# Altium schematic sheet Sheet2.SchDoc
size A4; DrawnBy: Erhan YILMAZ; Engineer: Erhan YILMAZ; SheetNumber: 2; SheetTotal: 2; ProjectName: BMS
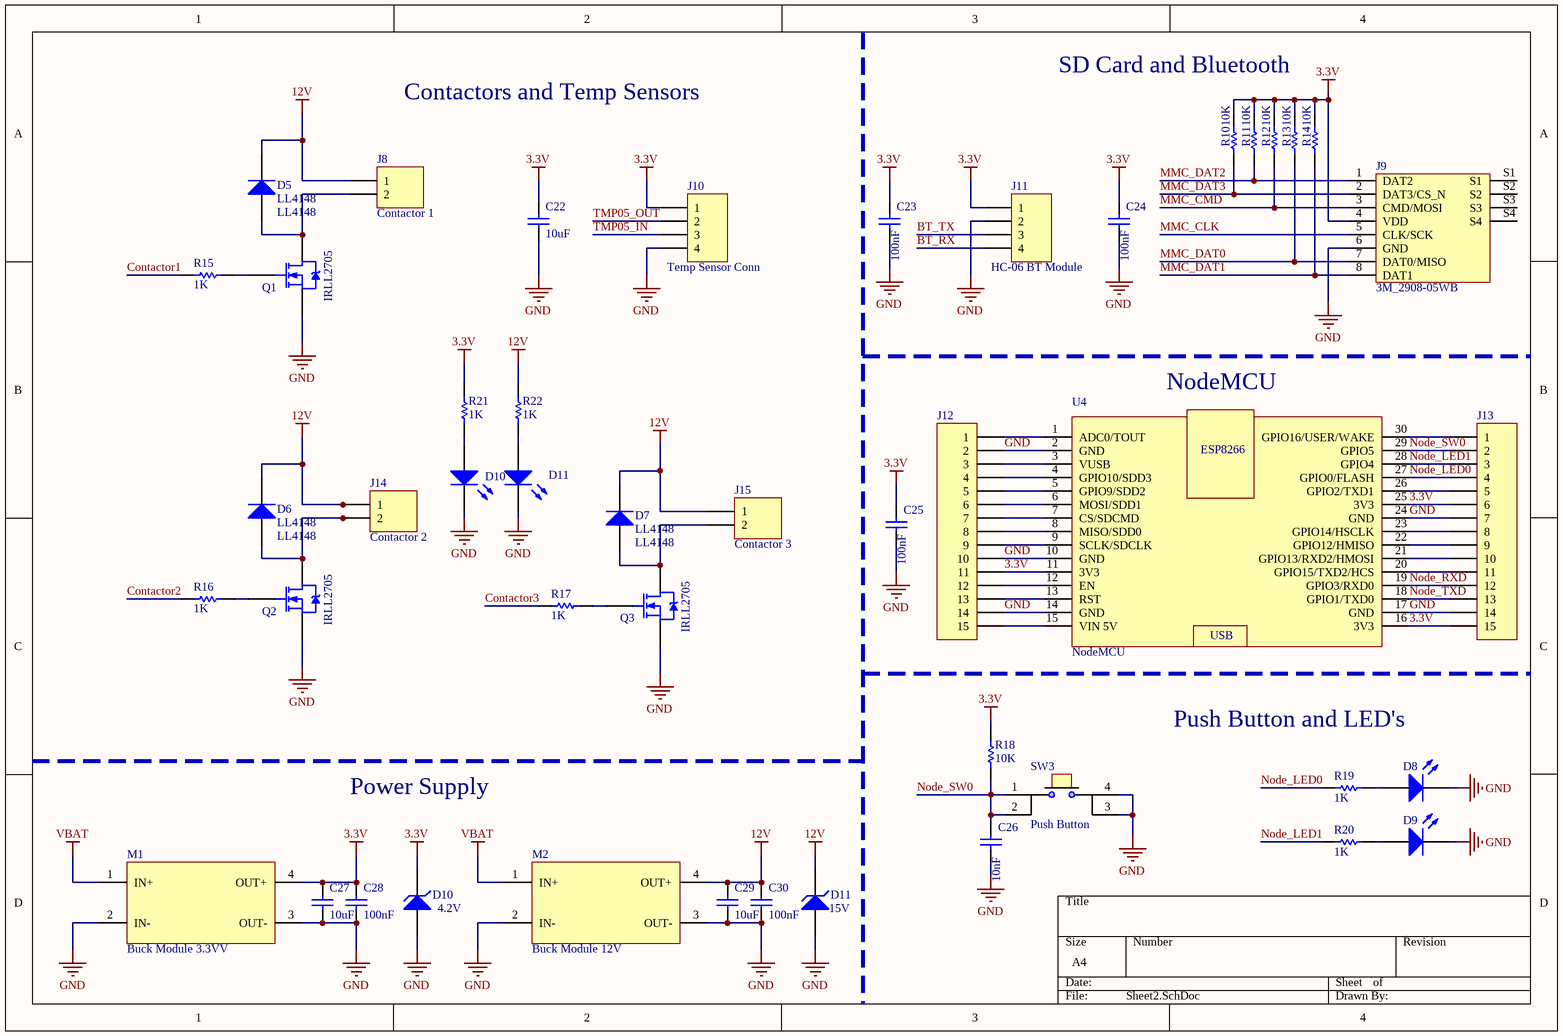
[diagram p0: Sheet2.SchDoc]

## Parts
(Parts that share a designator on the sheet are numbered #1, #2 ... from top to bottom, then left to right.)
C22  10uF  [C0805]
C23  100nF  [1608[0603]]
C24  100nF  [1608[0603]]
C25  100nF  [1608[0603]]
C26  10nF  [1608[0603]]
C27  10uF  [C0805]
C28  100nF  [1608[0603]]
C29  10uF  [C0805]
C30  100nF  [1608[0603]]
D5  LL4148  [LL4148]
D6  LL4148  [LL4148]
D7  LL4148  [LL4148]
D8  SMD LED  [C0805]  (value not drawn)
D9  SMD LED  [C0805]  (value not drawn)
D10#1  SMD LED  [C0805]  (value not drawn)
D10#2  value 4.2V  [LL4148]  (hidden comment: 4.2V SMD Zener Diode)
D11#1  SMD LED  [C0805]  (value not drawn)
D11#2  value 15V  [LL4148]  (hidden comment: 15V SMD Zener Diode)
J8  Contactor 1  [2 Pin Header]
J9  3M_2908-05WB  [3M_2908-05WB]
J10  Temp Sensor Conn  [4 Pin Header]
J11  HC-06 BT Module  [HDR1X4]
J12  Header, 15-Pin  [HDR1X15]  (value not drawn)
J13  Header, 15-Pin  [HDR1X15]  (value not drawn)
J14  Contactor 2  [2 Pin Header]
J15  Contactor 3  [2 Pin Header]
M1  Buck Module 3.3VV  [Buck Module]
M2  Buck Module 12V  [Buck Module]
Q1  IRLL2705  [SOT223_M]
Q2  IRLL2705  [SOT223_M]
Q3  IRLL2705  [SOT223_M]
R10  10K  [1608[0603]]
R11  10K  [1608[0603]]
R12  10K  [1608[0603]]
R13  10K  [1608[0603]]
R14  10K  [1608[0603]]
R15  1K  [1608[0603]]
R16  1K  [1608[0603]]
R17  1K  [1608[0603]]
R18  10K  [1608[0603]]
R19  1K  [1608[0603]]
R20  1K  [1608[0603]]
R21  1K  [1608[0603]]
R22  1K  [1608[0603]]
SW3  Push Button  [Push Button SMD]
U4  NodeMCU  [NodeMCU]

## Nets
3.3V: C22.2 C23.2 C24.2 C25.2 C27.2 C28.2 D10#2.2(K) J9.4(VDD) J10.1 J11.1 J12.11 J13.6 J13.15 M1.4(OUT+) R10.2 R11.2 R12.2 R13.2 R14.2 R18.1 R21.2 U4.11(3V3) U4.16(3V3) U4.25(3V3)
12V: C29.2 C30.2 D5.2(K) D6.2(K) D7.2(K) D11#2.2(K) J8.1 J14.1 J15.1 M2.4(OUT+) R22.2
GND: C22.1 C23.1 C24.1 C25.1 C26.1 C27.1 C28.1 C29.1 C30.1 D8.2(K) D9.2(K) D10#1.2(K) D10#2.1(A) D11#1.2(K) D11#2.1(A) J9.6(GND) J10.4 J11.2 J12.2 J12.10 J12.14 J13.7 J13.14 M1.2(IN-) M1.3(OUT-) M2.2(IN-) M2.3(OUT-) Q1.3(S) Q2.3(S) Q3.3(S) SW3.3 SW3.4 U4.2(GND) U4.10(GND) U4.14(GND) U4.17(GND) U4.24(GND)
VBAT: M1.1(IN+) M2.1(IN+)
BT_RX: J11.4
BT_TX: J11.3
Contactor1: R15.2
Contactor2: R16.2
Contactor3: R17.2
MMC_CLK: J9.5(CLK/SCK)
MMC_CMD: J9.3(CMD/MOSI) R12.1
MMC_DAT0: J9.7(DAT0/MISO) R13.1
MMC_DAT1: J9.8(DAT1) R14.1
MMC_DAT2: J9.1(DAT2) R11.1
MMC_DAT3: J9.2(DAT3/CS_N) R10.1
Node_LED0: J13.4 R19.2 U4.27(GPIO0/FLASH)
Node_LED1: J13.3 R20.2 U4.28(GPIO4)
Node_RXD: J13.12 U4.19(GPIO3/RXD0)
Node_SW0: C26.2 J13.2 R18.2 SW3.1 SW3.2 U4.29(GPIO5)
Node_TXD: J13.13 U4.18(GPIO1/TXD0)
TMP05_IN: J10.3
TMP05_OUT: J10.2
NetD5_1: D5.1(A) J8.2 Q1.2(D)
NetD6_1: D6.1(A) J14.2 Q2.2(D)
NetD7_1: D7.1(A) J15.2 Q3.2(D)
NetD8_1: D8.1(A) R19.1
NetD9_1: D9.1(A) R20.1
NetD10#1_1: D10#1.1(A) R21.1
NetD11#1_1: D11#1.1(A) R22.1
NetJ12_1: J12.1 U4.1(ADC0/TOUT)
NetJ12_3: J12.3 U4.3(VUSB)
NetJ12_4: J12.4 U4.4(GPIO10/SDD3)
NetJ12_5: J12.5 U4.5(GPIO9/SDD2)
NetJ12_6: J12.6 U4.6(MOSI/SDD1)
NetJ12_7: J12.7 U4.7(CS/SDCMD)
NetJ12_8: J12.8 U4.8(MISO/SDD0)
NetJ12_9: J12.9 U4.9(SCLK/SDCLK)
NetJ12_12: J12.12 U4.12(EN)
NetJ12_13: J12.13 U4.13(RST)
NetJ12_15: J12.15 U4.15(VIN_5V)
NetJ13_1: J13.1 U4.30(GPIO16/USER/WAKE)
NetJ13_5: J13.5 U4.26(GPIO2/TXD1)
NetJ13_8: J13.8 U4.23(GPIO14/HSCLK)
NetJ13_9: J13.9 U4.22(GPIO12/HMISO)
NetJ13_10: J13.10 U4.21(GPIO13/RXD2/HMOSI)
NetJ13_11: J13.11 U4.20(GPIO15/TXD2/HCS)
NetQ1_1: Q1.1(G) R15.1
NetQ2_1: Q2.1(G) R16.1
NetQ3_1: Q3.1(G) R17.1

Not connected (* = marked no-connect by the designer): J9 S1 S2 S3 S4

## Notes on the sheet
- Contactors and Temp Sensors
- SD Card and Bluetooth
- (near U4) NodeMCU
- Push Button and LED's
- Power Supply
- (in symbol NodeMCU) ESP8266; USB

## Library data of the parts
C22-C30 = Cap Semi: Published: 8-Jun-2000; LatestRevisionDate: 29-May-2009; LatestRevisionNote: IPC-7351 Footprint Added.; PackageReference: C1206; Publisher: Altium Limited; PackageDescription: Chip Capacitor
  C22 C27 C29: Value: 10uF
  C23-C25 C28 C30: Value: 100nF
  C26: Value: 10nF
D5-D7 = LL4148: LL4148 Fast SMD Diode; Value: LL4148
D8 D9 D10#1 D11#1 = LED0: Published: 8-Jun-2000; LatestRevisionDate: 08-Jul-2005; LatestRevisionNote: Mech Layer 1 removed.; PackageReference: LED-0; Publisher: Altium Limited; PackageDescription: LED; 2 Leads; Value: SMD LED
D10#2 D11#2 = D Zener: Published: 8-Jun-2000; LatestRevisionDate: 17-Jul-2002; LatestRevisionNote: Re-released for DXP Platform.; PackageReference: DIODE-0.7; Publisher: Altium Limited; PackageDescription: Diode, Thru-Hole; 2 Leads; 0.7 in Pin Spacing
J8 J14 J15 = 2 Pin Header: Value: 2 Pin Header
J9 = SD/MMC Card: Value: 3M_2908-05WB
J10 J11 = MHDR1X4: Header, 4-Pin; LatestRevisionDate: 17-Jul-2002; LatestRevisionNote: Re-released for DXP Platform.; Publisher: Altium Limited; Value: Header, 4-Pin
J12 J13 = MHDR1X15: LatestRevisionDate: 17-Jul-2002; LatestRevisionNote: Re-released for DXP Platform.; Publisher: Altium Limited; Value: Header, 15-Pin
M1 M2 = LM2596HVS Module: LM2596HVS/LM2596S Buck Converter Module
Q1-Q3 = NMOS-2: Note: Pin 2 is electrically connected to pin 4.; Published: 8-Jun-2000; LatestRevisionDate: 17-Jul-2002; LatestRevisionNote: Re-released for DXP Platform.; DatasheetVersion: PD-9.814; PackageVersion: Feb-1997; PackageReference: TO-220AB; Publisher: Altium Limited; PackageDescription: TO, Thru-Hole, Vertical, Heatsink Mounted; 3 In-Line Leads; Pitch 2.54 mm; ComponentLink1Description: Manufacturer Link; ComponentLink1URL: http://www.irf.com/; Value: IRLL2705
R10-R22 = Res1: Published: 8-Jun-2000; LatestRevisionDate: 17-Jul-2002; LatestRevisionNote: Re-released for DXP Platform.; PackageReference: AXIAL-0.3; Publisher: Altium Limited; PackageDescription: Axial Device, Thru-Hole; 2 Leads; 0.3 in Pin Spacing
  R10-R14 R18: Value: 10K
  R15-R17 R19-R22: Value: 1K
SW3 = Push Button: General purposes push button; Value: Push Button
U4 = NodeMCU: LoLin NodeMCU V0.1